# Altium schematic sheet 3V3_LDO_1A.SchDoc: 3V3_BUCK
size 431 x 279 mm; Author: Shivam Sharma; SheetNumber: 7; SheetTotal: 14; SheetRevision: 1.0
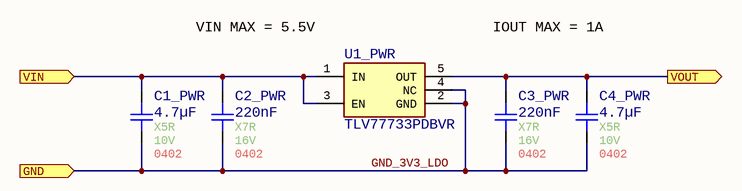
[diagram p0: 3V3_LDO_1A.SchDoc]

## Parts
C1_PWR  value 4.7µF  Temperature Coefficient: X5R  Voltage Rating: 10V  Case/Package: 0402  [Generic 0402 capacitor]  (hidden comment: GRT155R61A475ME13D)
C2_PWR  value 220nF  Temperature Coefficient: X7R  Voltage Rating: 16V  Case/Package: 0402  [Generic 0402 capacitor]  (hidden comment: GCM155R71C224ME02D)
C3_PWR  value 220nF  Temperature Coefficient: X7R  Voltage Rating: 16V  Case/Package: 0402  [Generic 0402 capacitor]  (hidden comment: GCM155R71C224ME02D)
C4_PWR  value 4.7µF  Temperature Coefficient: X5R  Voltage Rating: 10V  Case/Package: 0402  [Generic 0402 capacitor]  (hidden comment: GRT155R61A475ME13D)
U1_PWR  TLV77733PDBVR  [SOT23-3_3x5x1.1mm_P0.95mm]

## Ports
GND (in), VIN (in), VOUT (out)

## Nets
GND_3V3_LDO: C1_PWR.1 C2_PWR.1 C3_PWR.1 C4_PWR.1 U1_PWR.2(GND) U1_PWR.4(NC) ; port GND
VIN: C1_PWR.2 C2_PWR.2 U1_PWR.1(IN) U1_PWR.3(EN) ; port VIN
VOUT: C3_PWR.2 C4_PWR.2 U1_PWR.5(OUT) ; port VOUT

## Notes on the sheet
- VIN MAX = 5.5V
- IOUT MAX = 1A
- Title:
- Author:
- Approved:
- Size:
- Date:
- Git Hash:
- Sch Revision:
- B
- Prj:
- Sheet Revision:
- Variant:
- Edited:
- CONFIDENTIAL
- File:

## Library data of the parts
C1_PWR C4_PWR = CMP-001-00085-5: Ceramic Capacitor, Multilayer, Ceramic, 10V, 20% +Tol, 20% -Tol, X5R, 15% TC, 4.7uF, Surface Mount, 0402; Tolerance: 0%; AECQ: Yes; RoHS Compliant: Yes; Min Operating Temperature: -55°C; Capacitor Type: Ceramic; Tolerance  (fill in as +-): 20%; Termination: Wraparound; Packaging: Tape and Reel; Max Operating Temperature: 85°C; Mounting Technology: Surface Mount; Dielectric Material: Ceramic; Tolerance (fill in as +-): 20%; Pins: 2; Rated DC Voltage (URdc): 10V; Reach SVHC Compliant: Yes; Package Shape: Rectangular; Multilayer: Yes
C2_PWR C3_PWR = CMP-001-00103-2: Ceramic Capacitor, Multilayer, Ceramic, 16V, 20% +Tol, 20% -Tol, X7R, 15% TC, 0.22uF, Surface Mount, 0402; AECQ: Yes; Max Operating Temperature: 125°C; Min Operating Temperature: -55°C; Mounting Technology: SMD; Pins: 2; Capacitor Type: Ceramic; Tolerance: 20%
U1_PWR = CMP-019-00069-1: 1A small-size high-PSRR low-dropout (LDO) regulator with enable 5-SOT-23 -40 to 125; Max Supply Voltage: 5.5V; Nominal Supply Current: 141µA; Min Supply Voltage: 1.45V; Output Voltage: 3.3V; Dropout Voltage: 585mV; Case/Package: SOT-23-5; Pins: 5; Min Operating Temperature: -40°C; Max Operating Temperature: 125°C; RoHS Compliant: Yes; Mounting Technology: SMD; Output Current: 1A